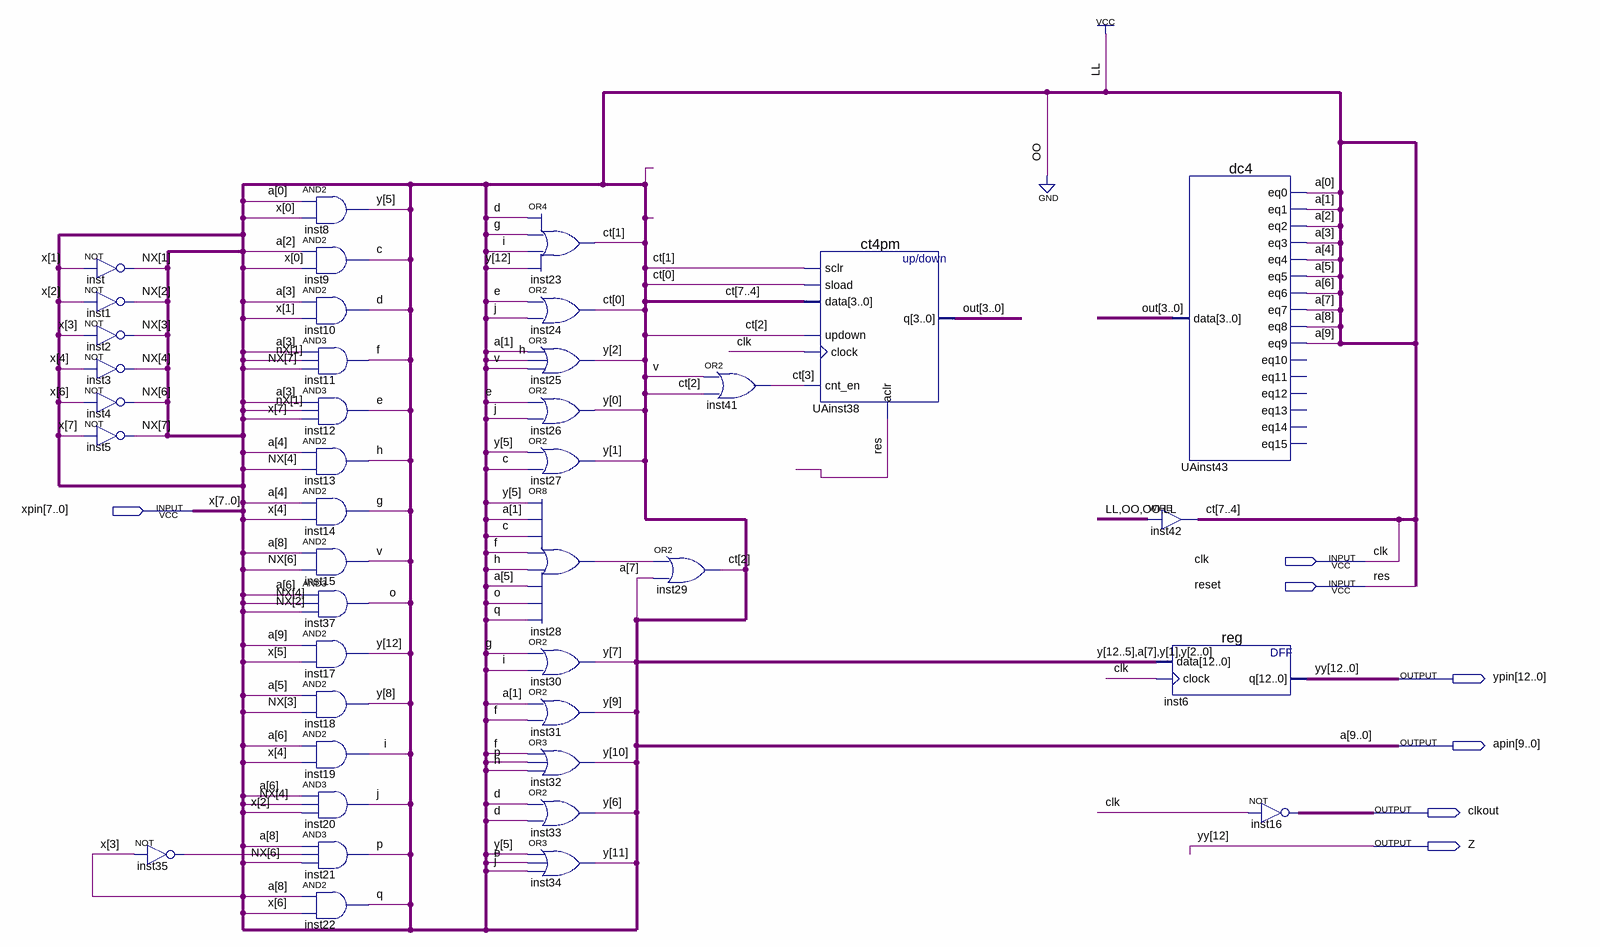
[diagram p0: schematic sheet]
// Quartus schematic lab2.bdf as structural Verilog: 40 symbols, 7 pins
module lab2 (
  input  [7:0] xpin,
  input  clk,
  input  reset,
  output [12:0] ypin,
  output [9:0] apin,
  output clkout,
  output Z
);

  wire c, d, e, f, g, h, i, inst28_out, inst35_out, j, o, p, q, v;
  wire [3:0] out;
  wire [7:0] ct;
  wire [7:1] NX;
  wire [12:0] y;

  not inst (NX[1], xpin[1]);
  not inst1 (NX[2], xpin[2]);
  not inst2 (NX[3], xpin[3]);
  not inst3 (NX[4], xpin[4]);
  not inst4 (NX[6], xpin[6]);
  not inst5 (NX[7], xpin[7]);
  not inst35 (inst35_out, xpin[3]);
  and inst8 (y[5], apin[0], xpin[0]);
  and inst9 (c, apin[2], xpin[0]);
  and inst10 (d, apin[3], xpin[1]);
  and inst11 (f, apin[3], NX[1], NX[7]);
  and inst12 (e, apin[3], NX[1], xpin[7]);
  and inst13 (h, apin[4], NX[4]);
  and inst14 (g, apin[4], xpin[4]);
  and inst15 (v, apin[8], NX[6]);
  and inst37 (o, apin[6], NX[4], NX[2]);
  and inst17 (y[12], apin[9], xpin[5]);
  and inst18 (y[8], apin[5], NX[3]);
  and inst19 (i, apin[6], xpin[4]);
  and inst20 (j, apin[6], NX[4], xpin[2]);
  and inst21 (p, apin[8], inst35_out, NX[6]);
  and inst22 (q, apin[8], xpin[6]);
  or inst23 (ct[1], d, g, i, y[12]);
  or inst24 (ct[0], e, j);
  or inst25 (y[2], apin[1], h, v);
  or inst26 (y[0], e, j);
  or inst27 (y[1], y[5], c);
  or inst28 (inst28_out, y[5], apin[1], c, f, h, apin[5], o, q);
  or inst30 (y[7], g, i);
  or inst31 (y[9], apin[1], f);
  or inst32 (y[10], f, p, h);
  or inst33 (y[6], d, d);
  or inst34 (y[11], y[5], e, j);
  or inst41 (ct[3], v, ct[2]);
  or inst29 (ct[2], inst28_out, apin[7]);
  ct4pm UAinst38 (
    .sclr(ct[1]), .sload(ct[0]), .data(ct[7:4]), .updown(ct[2]), .clock(clk), .cnt_en(ct[3]), .aclr(reset),
    .q(out));
  dc4 UAinst43 (
    .data(out), .eq0(apin[0]), .eq1(apin[1]), .eq2(apin[2]), .eq3(apin[3]), .eq4(apin[4]), .eq5(apin[5]),
    .eq6(apin[6]), .eq7(apin[7]), .eq8(apin[8]), .eq9(apin[9]));  // open: eq10, eq11, eq12, eq13, eq14, eq15
  assign ct[7:4] = 4'b1001;  // WIRE inst42
  \reg  inst6 (.data({y[12:5], apin[7], y[1], y[2:0]}), .clock(clk), .q(ypin));
  not inst16 (clkout, clk);

  assign Z = ypin[12];

  // Other names for the same wires on the sheet: a[9:0] = apin; res = reset; x[7:0] = xpin; yy[12:0] = ypin
endmodule
